# Altium schematic sheet DM.SchDoc
size A2; SPICEModelCacheAXZJKOIU: <root> / <DocumentId>AXZJKOIU</DocumentId> / <CacheFrame Number="0"> / <Model Name="mcp65r41_2402" Kind="CKT"> / <Text>.SUBCKT MCP65R41_2402 1 2 3 4 5 6 / *                     | | | | | | / *                     | | | | | VRef / *                     | | | | Output / *                     | | | Negative Supply / *                     | | Positive Supply / *                     | Inverting Input / *                     Non-inverting Input / * / ******************************************************************************** / * Software License Agreement                                                   * / *                                                                              * / * The software supplied herewith by Microchip Technology Incorporated (the     * / * 'Company') is intended and supplied to you, the Company's customer, for use  * / * soley and exclusively on Microchip products.                                 * / *                                                                              * / * The software is owned by the Company and/or its supplier, and is protected   * / * under applicable copyright laws. All rights are reserved. Any use in         * / * violation of the foregoing restrictions may subject the user to criminal     * / * sanctions under applicable laws, as well as to civil liability for the       * / * breach of the terms and conditions of this license.                          * / *                                                                              * / * THIS SOFTWARE IS PROVIDED IN AN 'AS IS' CONDITION. NO WARRANTIES, WHETHER    * / * EXPRESS, IMPLIED OR STATUTORY, INCLUDING, BUT NOT LIMITED TO, IMPLIED        * / * WARRANTIES OF MERCHANTABILITY AND FITNESS FOR A PARTICULAR PURPOSE APPLY TO  * / * THIS SOFTWARE. THE COMPANY SHALL NOT, IN ANY CIRCUMSTANCES, BE LIABLE FOR    * / * SPECIAL, INCIDENTAL OR CONSEQUENTIAL DAMAGES, FOR ANY REASON WHATSOEVER.     * / ******************************************************************************** / * / * The following op-amps are covered by this model: / *      MCP65R41_2402 / * / * / * Revision History: / *      REV A: 19-May-11, Created model / * / * / * / * / * Recommendations: / *      Use PSPICE (or SPICE 2G6; other simulators may require translation) / *      For a quick, effective design, use a combination of: data sheet / *            specs, bench testing, and simulations with this macromodel / *      For high impedance circuits, set GMIN=100F in the .OPTIONS statement / *      Can disable Hysteresis for faster response in large circuits by adding comments / *      in front of statements flagged below / * / * Supported: / *      Typical performance for temperature range (-40 to 125) degrees Celsius / *      DC, AC, Transient, and Noise analyses. / *      Most specs, including: offsets, DC PSRR, DC CMRR, input impedance, / *            open loop gain, voltage ranges, supply current, ... , etc. / *      Temperature effects for Ibias, Iquiescent, Iout short circuit / *            current, Vsat on both rails, Slew Rate vs. Temp and P.S. / * / * Not Supported: / *      Some Variation in specs vs. Power Supply Voltage / *      Vos distribution, Ib distribution for Monte Carlo / *      Distortion (detailed non-linear behavior) / *      Some Temperature analysis / *      Process variation / *      Behavior outside normal operating region / * / * / * / * Input Stage / * / V10  3 10 -500M / R10 10 11 218K / R11 10 12 218K / G10 10 11 10 11 458U / G11 10 12 10 12 458U / C11 11 12 1.82E-15 / C12  1  0 4.00P / *E12 71 14 POLY(6) 20 0 21 0 22 0 23 0 26 0 27 0   0.00 49.3K 49.3K 49.3K 49.3K 1 1 / E12 71 14 POLY(7) 20 0 21 0 22 0 23 0 26 0 27 0 111 0 / + 0.00 55 55 15 15 1 1 -.5M / *+ 1.5M 55 55 15 15 1 1 -.5M / * LINE ABOVE FOR HYSTERESIS, LINE BELOW FOR NO HYSTERESIS / *+ 1.5M 55 55 15 15 1 1 0 / G12 1 0 62 0 1m / G13 1 2 63 0 1u / M12 11 14 15 15 NMI / M14 12 2 15 15 NMI / G14 2 0 62 0 1m / C14  2  0 4.00P / I15 15 4 500U / V16 16 4 -300M / GD16 16 1 TABLE {V(16,1)} ((-100,-100E-15)(0,0)(1m,1u)(2m,1m)) / V13 3 13 -300M / GD13 2 13 TABLE {V(2,13)} ((-100,-100E-15)(0,0)(1m,1u)(2m,1m)) / R71  1  0 10.0E12 / R72  2  0 10.0E12 / R73  1  2 10.0E12 / C13  1  2 2.00P / * / * Noise, PSRR, and CMRR / * / I20 21 20 423U / D20 20  0 DN1 / D21  0 21 DN1 / I22 22 23 1N / R22 22 0  1k / R23  0 23 1k / G26  0 26 POLY(2) 3 0 4 0   0.00 -70.7U -125U / R26 26  0 1 / G27  0 27 POLY(2) 1 0 2 0  -2.19M 125U 125U / R27 27  0 1 / * / * Open Loop Gain, Slew Rate / * / G30  0 30 12 11 1 / R30 30  0 1.00K / G31 0 31 3 4 18.6 / I31 0 31 DC -82.1M / R31 31  0 1 TC=0.00,0.00 / GD31 30 0 TABLE {V(30,31)} ((-100,-1n)(0,0)(1m,0.1)(2m,2)) / G32 32 0 3 4 18.6 / I32 32 0 DC -82.1M / R32 32  0 1 TC=0.00,0.00 / GD32 0 30 TABLE {V(30,32)} ((-2m,2)(-1m,0.1)(0,0)(100,-1n)) / G33  0 33 30 0 1m / R33  33 0 1K / G34  0 34 33 0 1.00 / R34  34 0 1K / C34  34 0 15.9U / G37  0 37 34 0 1m / R37  37 0 1K / C37  37 0 15.9E-15 / G38  0 38 37 0 1m / R38  39 0 1K / L38  38 39 15.9N / E38  35 0 38 0 1 / G35 33 0 TABLE {V(35,3)} ((-1,-1n)(0,0)(2.00,1n))(2.2,1)) / G36 33 0 TABLE {V(35,4)} ((-2.2,-1)((-2.00,-1n)(0,0)(1,1n)) / * / * Output Stage / * / R80 50 0 100MEG / G50 0 50 57 96 2 / R58 57  96 0.50 / R57 57  0 10.0 / C58  5  0 2.00P / G57  0 57 POLY(3) 3 0 4 0 35 0 0 37.5M 50.0M 100M / GD55 55 57 TABLE {V(55,57)} ((-2m,-1)(-1m,-1m)(0,0)(10,1n)) / GD56 57 56 TABLE {V(57,56)} ((-2m,-1)(-1m,-1m)(0,0)(10,1n)) / E55 55  0 POLY(2) 3 0 51 0 4.7M 1 -48.5M / E56 56  0 POLY(2) 4 0 52 0 9.9M 1 -36.5M / R51 51 0 1k / R52 52 0 1k / GD51 50 51 TABLE {V(50,51)} ((-10,-1n)(0,0)(1m,1m)(2m,1)) / GD52 50 52 TABLE {V(50,52)}  ((-2m,-1)(-1m,-1m)(0,0)(10,1n)) / G53  3  0 POLY(1) 51 0  -500U 1M / G54  0  4 POLY(1) 52 0  -500U -1M / * / * Current Limit / * / G99 96 5 99 0 1 / R98 0 98 1 TC=-2.45M,-4.74U / G97 0 98 TABLE { V(96,5) } ((-11.0,-14.0M)(-1.00M,-13.8M)(0,0)(1.00M,13.8M)(11.0,14.0M)) / *E97 99 0 VALUE { V(98)*((V(3)-V(4))*738M + -1.21)} / E97 99 0 VALUE { V(98)*LIMIT(((V(3)-V(4))*738M + -1.21),0.00,1E6)} / D98 4 5 DESD / D99 5 3 DESD / * / * Temperature / Voltage Sensitive IQuiscent / * / R61 0 61 1 TC=3.54M,-1.28U / G61 3 4 61 0 1 / G60 0 61 TABLE {V(3, 4)} / *+ ((0,0)(600M,25.1N)(1.8,2.5U)(2.00,2.5U) / + ((0,0)(600M,25.1N)(0.85,0.50u)(1.15,2.5u)(1.2,3u)(1.35,3.7u)(1.4,3.8u)(1.45,3.7u)(1.5,2.5u)(1.8,2.5U)(2.00,2.5U) / + (3.00,2.5U)(5.00,2.51U)(6.00,2.52U)) / * / * Temperature Sensitive offset voltage / * / I73 0 70 DC 1uA / *R74 0 70 1 TC=10.0 / R74 0 70 1 TC=0.00 / E75 1 71 70 0 1 / * / * Temp Sensistive IBias / * / I62 0 62 DC 1uA / R62 0 62 REXP  349.81393U / * / * Temp Sensistive Offset IBias / * / I63 0 63 DC 1uA / R63 0 63 200M TC=12.0M,128U / * / * Hysteresis / * / G110 0 110 POLY(2) 3 0 4 0  10.4 -50M 50M / R110 110 0 1 TC=0.5M,0 / E111 111 0 VALUE { V(110) * V(112) } / E112 112 0 TABLE {V(120,0)} ((-1,1)(-1m,0.99)(1m,-0.99)(1,-1)) / C120  120 0  1u / G120 0 120 TABLE {V(57,4)} ((-1m,-1)(1m,1)) / R120 0 120 1 / C121 121 120 2p / C122 122 120 2p / V121 121 0 1 / V122 122 0 -1 / * Node 120 above is output of FF.  Can substitute with node 57 for / * direct input from output state. / * / * Begin - VRef Subcircuit Added 05-16-11 / * / R200 4 200  1 TC=3.35e-5,-4.55e-7 / E200 201 4 200 4 1 / VF200 202 6 0 / F200 3 4 VF200 1 / G200 201 202 TABLE { V(201, 202) } / + ( (-5.5,-0.010)(-1u,-500u)(0,0) (1u,500u)(5.5,0.012) ) / G201 4 200 TABLE { V(3, 4) } / + ( (0,0)(1.79,0.0)(1.80,1.80)(2.35,2.35)(2.37,2.37)(2.39,2.39)(2.40,2.40)(5.5,2.40)) / * / * End - VRef Subcircuit / * / * Models / .MODEL NMI NMOS(L=2.00U W=42.0U KP=20.0U LEVEL=1 ) / .MODEL DESD  D   N=1 IS=1.00E-15 / .MODEL DN1 D   IS=1P KF=50.0P AF=1 / .MODEL REXP  RES TCE= 7.71929 / .ENDS MCP65R41_2402</Text> / </Model> / </CacheFrame> / </root>
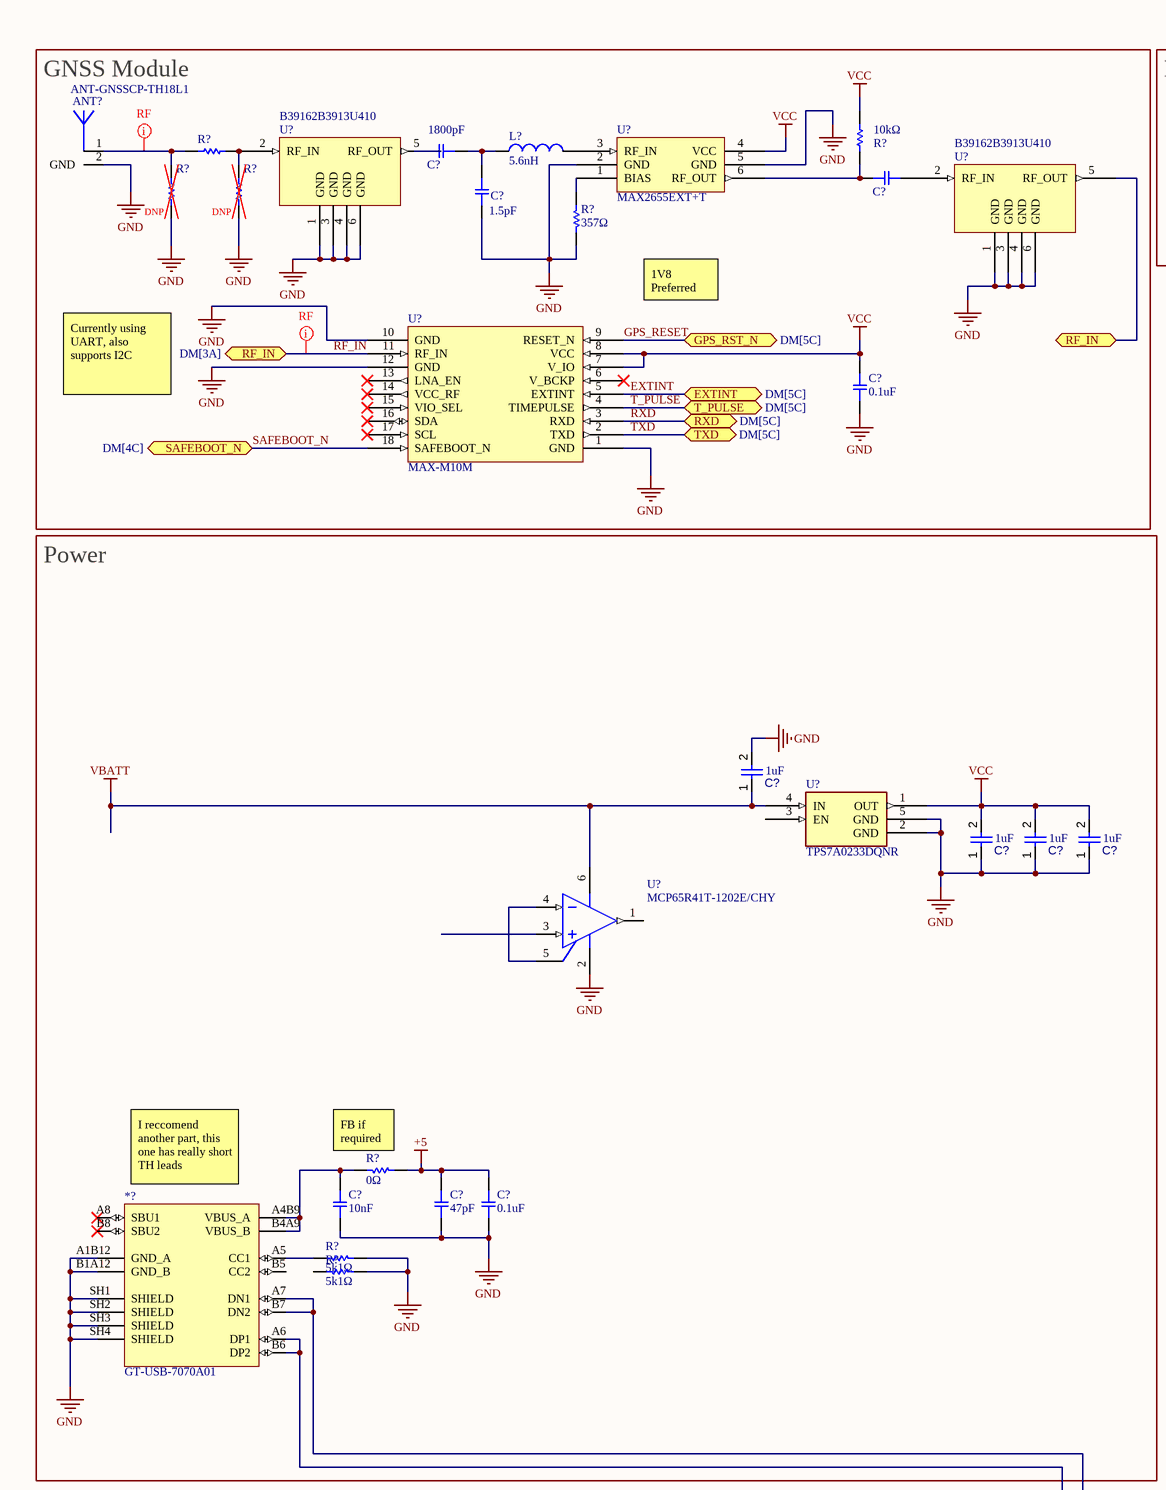
[diagram p0: DM.SchDoc, left]
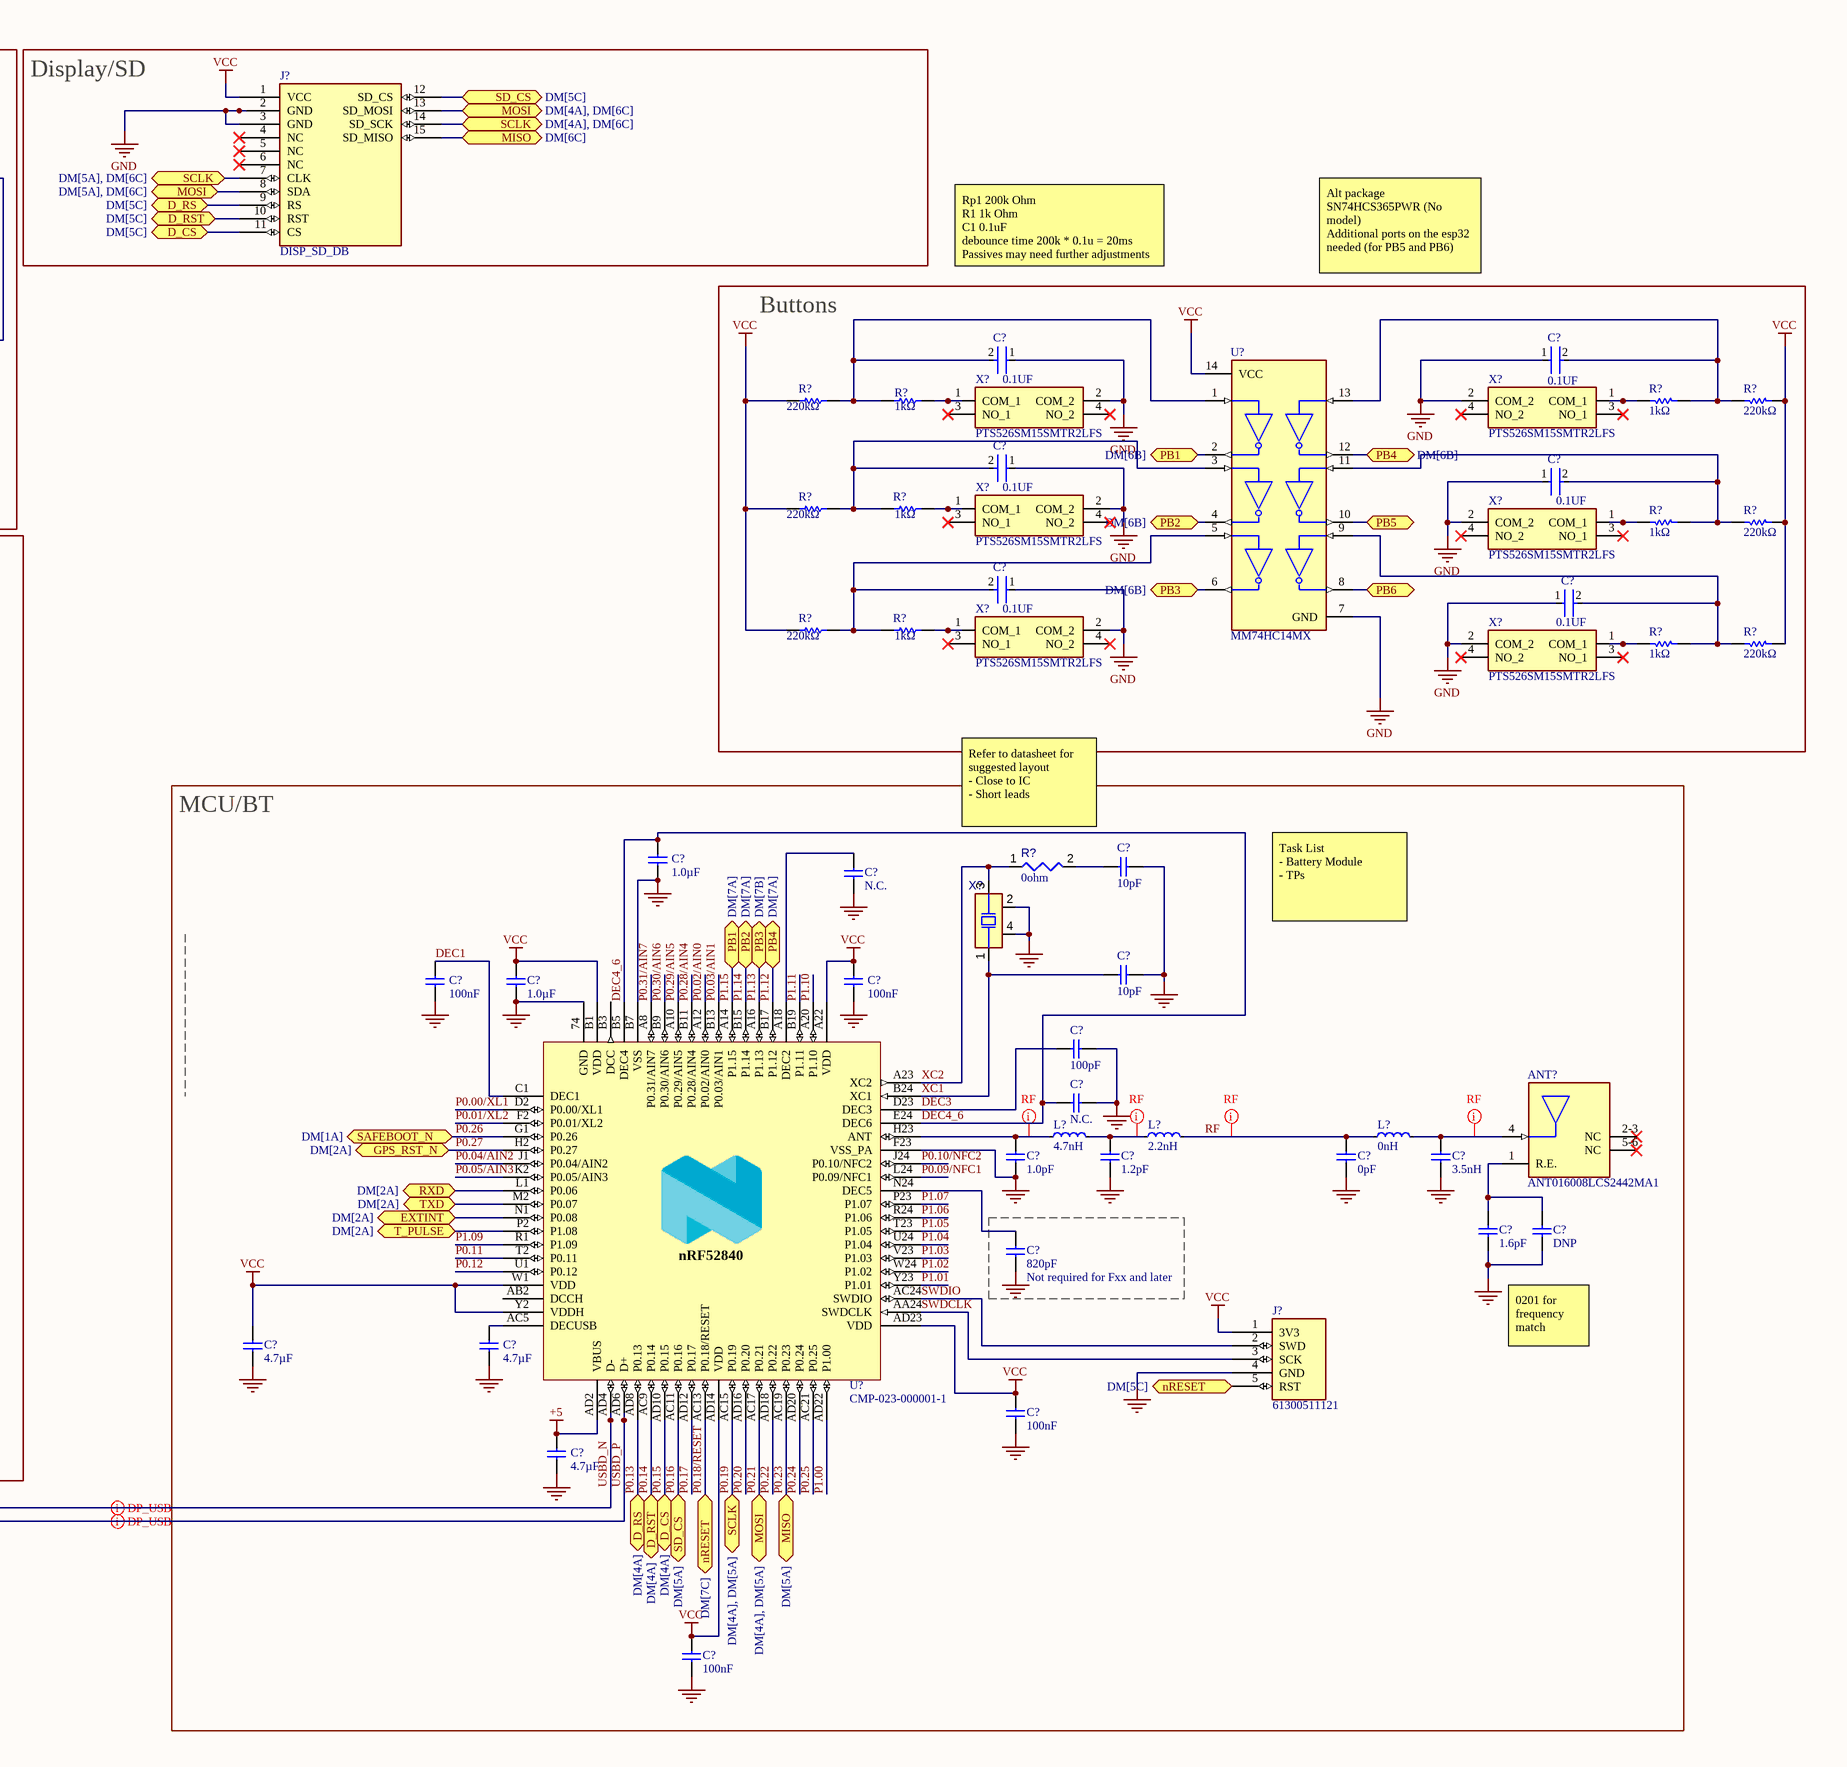
[diagram p1: DM.SchDoc, right]

## Parts
(Parts that share a designator on the sheet are numbered #1, #2 ... from top to bottom, then left to right.)
*?  GT-USB-7070A01  [GT-USB-7070A01-Footprint-1]
ANT?#1  ANT-GNSSCP-TH18L1  [ANT-GNSSCP-TH18L1]
ANT?#2  ANT016008LCS2442MA1  [FP-ANT016-MFG]
C?#1  Capacitance: 1800pF  [0402_CAP]  (hidden comment: GRM1555C1H102JA01D)
C?#2  GRM1555C1H102JA01D  [0402_CAP]  (value not drawn)
C?#3  Capacitance: 1.5pF  [0402_CAP]  (hidden comment: GRM1555C1H102JA01D)
C?#4  0.1UF  [FP-GRM15-MFG]
C?#5  0.1UF  [FP-GRM15-MFG]
C?#6  Capacitance: 0.1uF  [CAP_MURATA_0603]  (hidden comment: GCM188L81H104KA57D)
C?#7  0.1UF  [FP-GRM15-MFG]
C?#8  0.1UF  [FP-GRM15-MFG]
C?#9  0.1UF  [FP-GRM15-MFG]
C?#10  0.1UF  [FP-GRM15-MFG]
C?#11  value 1uF  (hidden comment: Capacitors,1uF)
C?#12  N.C.  [CAPC1005X04L]
C?#13  value 1uF  (hidden comment: Capacitors,1uF)
C?#14  value 1uF  (hidden comment: Capacitors,1uF)
C?#15  value 1uF  (hidden comment: Capacitors,1uF)
C?#16  10pF  [CAPC1005X04L]
C?#17  1.0µF  [CAPC1608X06L]
C?#18  100nF  [CAPC1005X04L]
C?#19  1.0µF  [CAPC1608X06L]
C?#20  100nF  [CAPC1005X04L]
C?#21  10pF  [CAPC1005X04L]
C?#22  100pF  [CAPC1005X04L]
C?#23  N.C.  [CAPC1005X04L]
C?#24  1.0pF  [CAPC1005X04L]
C?#25  1.2pF  [CAPC1005X04L]
C?#26  0pF  [CAPC1005X04L]
C?#27  3.5nH  [CAPC1005X04L]
C?#28  Capacitance: 10nF  [CAP_MURATA_0603]  (hidden comment: GCM188L81H104KA57D)
C?#29  Capacitance: 47pF  [CAP_MURATA_0603]  (hidden comment: GCM188L81H104KA57D)
C?#30  Capacitance: 0.1uF  [CAP_MURATA_0603]  (hidden comment: GCM188L81H104KA57D)
C?#31  820pF  Assembly: Not required for Fxx and later  [CAPC1005X04L]
C?#32  1.6pF  [CAPC1005X04L]
C?#33  DNP  [CAPC1005X04L]
C?#34  4.7µF  [CAPC1608X06L]
C?#35  4.7µF  [CAPC1608X06L]
C?#36  100nF  [CAPC1005X04L]
C?#37  4.7µF  [CAPC1608X06L]
C?#38  100nF  [CAPC1005X04L]
J?#1  CMP-010-000000-2  [DISP_SD_DB-Footprint-1]  (value not drawn)
J?#2  61300511121  [61300511121]
L?#1  value 5.6nH  [INDC1006X60N]  (hidden comment: LQW15AN3N6C10D)
L?#2  4.7nH  [INDC1005X04L]
L?#3  2.2nH  [INDC1005X04L]
L?#4  0nH  [INDC1005X04L]
R?#1  Resistance: 10kΩ  [0402_CAP]  (hidden comment: RC0402JR-070RL)
R?#2  RC0402JR-070RL  [0402_CAP]  (value not drawn)
R?#3  RC0402JR-070RL  [0402_CAP]  (value not drawn)
R?#4  RC0402JR-070RL  [0402_CAP]  (value not drawn)
R?#5  Resistance: 357Ω  [RC0603JR-070RL]
R?#6  220kΩ  [RESC2013X55X40ML15T20]
R?#7  1kΩ  [RESC2013X50X30ML20T20]
R?#8  1kΩ  [RESC2013X50X30ML20T20]
R?#9  220kΩ  [RESC2013X55X40ML15T20]
R?#10  220kΩ  [RESC2013X55X40ML15T20]
R?#11  1kΩ  [RESC2013X50X30ML20T20]
R?#12  1kΩ  [RESC2013X50X30ML20T20]
R?#13  220kΩ  [RESC2013X55X40ML15T20]
R?#14  220kΩ  [RESC2013X55X40ML15T20]
R?#15  1kΩ  [RESC2013X50X30ML20T20]
R?#16  1kΩ  [RESC2013X50X30ML20T20]
R?#17  220kΩ  [RESC2013X55X40ML15T20]
R?#18  value 0ohm  (hidden comment: Resistors,0ohm)
R?#19  Resistance: 0Ω  [RC0603JR-070RL]  (hidden comment: RC0603JR-070RL)
R?#20  Resistance: 5k1Ω  [RC0603JR-070RL]  (hidden comment: RC0603JR-070RL)
R?#21  Resistance: 5k1Ω  [RC0603JR-070RL]  (hidden comment: RC0603JR-070RL)
U?#1  B39162B3913U410  [B39162B3913U410]
U?#2  MAX2655EXT+T  [MAX2655EXT+T]
U?#3  B39162B3913U410  [B39162B3913U410]
U?#4  CMP-033-000000-1  [MAX-M10M]  (value not drawn)
U?#5  MM74HC14MX  [FP-751EF-IPC_A]
U?#6  TPS7A0233DQNR
U?#7  MCP65R41T-1202E/CHY  [SOT-23-CHY6_M]
U?#8  CMP-023-000001-1  [AQFN50P700X700X85_HS-74N]
X?#1  PTS526SM15SMTR2LFS  [PTS526SM15SMTR2LFS]
X?#2  PTS526SM15SMTR2LFS  [PTS526SM15SMTR2LFS]
X?#3  PTS526SM15SMTR2LFS  [PTS526SM15SMTR2LFS]
X?#4  PTS526SM15SMTR2LFS  [PTS526SM15SMTR2LFS]
X?#5  PTS526SM15SMTR2LFS  [PTS526SM15SMTR2LFS]
X?#6  PTS526SM15SMTR2LFS  [PTS526SM15SMTR2LFS]
X?#7  FA-128 32.0000MF20X-K5  [BT-XTAL_2016]  (value not drawn)

## Blocks framed on the sheet
GNSS Module: ANT?#1 C?#1-C?#3 C?#6 L?#1 R?#1-R?#5 U?#1-U?#4
Display/SD: J?#1
Buttons: C?#4 C?#5 C?#7-C?#10 R?#6-R?#17 U?#5 X?#1-X?#6
Power: *? C?#11 C?#13-C?#15 C?#28-C?#30 R?#19-R?#21 U?#6 U?#7
MCU/BT: ANT?#2 C?#12 C?#16-C?#27 C?#31-C?#38 J?#2 L?#2-L?#4 R?#18 U?#8 X?#7

## Ports
D_CS (bidir, see DM[4A]), D_CS (bidir, see DM[5C]), D_RS (bidir, see DM[4A]), D_RS (bidir, see DM[5C]), D_RST (bidir, see DM[4A]), D_RST (bidir, see DM[5C]), EXTINT (bidir, see DM[2A]), EXTINT (bidir, see DM[5C]), GPS_RST_N (bidir, see DM[2A]), GPS_RST_N (bidir, see DM[5C]), MISO (bidir, see DM[5A]), MISO (bidir, see DM[6C]), MOSI (bidir, see DM[4A], DM[5A]), MOSI (bidir, see DM[4A], DM[6C]), MOSI (bidir, see DM[5A], DM[6C]), nRESET (bidir, see DM[5C]), nRESET (bidir, see DM[7C]), PB1 (bidir, see DM[6B]), PB1 (bidir, see DM[7A]), PB2 (bidir, see DM[6B]), PB2 (bidir, see DM[7A]), PB3 (bidir, see DM[6B]), PB3 (bidir, see DM[7B]), PB4 (bidir, see DM[6B]), PB4 (bidir, see DM[7A]), PB5 (bidir), PB6 (bidir), RF_IN (bidir, see DM[1A]), RF_IN (bidir, see DM[3A]), RXD (bidir, see DM[2A]), RXD (bidir, see DM[5C]), SAFEBOOT_N (bidir, see DM[1A]), SAFEBOOT_N (bidir, see DM[4C]), SCLK (bidir, see DM[4A], DM[5A]), SCLK (bidir, see DM[4A], DM[6C]), SCLK (bidir, see DM[5A], DM[6C]), SD_CS (bidir, see DM[5A]), SD_CS (bidir, see DM[5C]), T_PULSE (bidir, see DM[2A]), T_PULSE (bidir, see DM[5C]), TXD (bidir, see DM[2A]), TXD (bidir, see DM[5C])

## Nets
+5: C?#29.1 C?#30.1 C?#37.1 R?#19.1 U?#8.AD2(VBUS)
GND: *?.A1B12(GND_A) *?.B1A12(GND_B) *?.SH1(SHIELD) *?.SH2(SHIELD) *?.SH3(SHIELD) *?.SH4(SHIELD) ANT?#1.2(GND) C?#3.1 C?#4.1 C?#5.1 C?#6.1 C?#7.1 C?#8.1 C?#9.1 C?#10.1 C?#11.2 C?#12.2 C?#13.1 C?#14.1 C?#15.1 C?#16.2 C?#17.1 C?#18.2 C?#19.2 C?#20.2 C?#21.2 C?#22.2 C?#23.1 C?#24.1 C?#25.1 C?#26.1 C?#27.1 C?#28.2 C?#29.2 C?#30.2 C?#31.2 C?#32.1 C?#33.1 C?#34.2 C?#35.2 C?#36.2 C?#37.2 C?#38.2 J?#1.2(GND) J?#1.3(GND) J?#2.4(GND) R?#3.1 R?#4.1 R?#5.2 R?#20.1 R?#21.1 U?#1.1(GND) U?#1.3(GND) U?#1.4(GND) U?#1.6(GND) U?#2.2(GND) U?#2.5(GND) U?#3.1(GND) U?#3.3(GND) U?#3.4(GND) U?#3.6(GND) U?#4.1(GND) U?#4.10(GND) U?#4.12(GND) U?#5.7(GND) U?#6.2(GND) U?#6.5(GND) U?#7.2(VSS) U?#8.74(GND) U?#8.B7(VSS) U?#8.F23(VSS_PA) X?#1.2(COM_2) X?#2.2(COM_2) X?#3.2(COM_2) X?#4.2(COM_2) X?#5.2(COM_2) X?#6.2(COM_2) X?#7.2(NC) X?#7.4(NC)
VBATT: C?#11.1 U?#6.4(IN) U?#7.6(VDD)
VCC: C?#6.2 C?#13.2 C?#14.2 C?#15.2 C?#19.1 C?#20.1 C?#34.1 C?#36.1 C?#38.1 J?#1.1(VCC) J?#2.1(3V3) R?#1.1 R?#6.1 R?#9.1 R?#10.1 R?#13.1 R?#14.1 R?#17.1 U?#2.4(VCC) U?#4.7(V_IO) U?#4.8(VCC) U?#5.14(VCC) U?#6.1(OUT) U?#8.A22(VDD) U?#8.AD14(VDD) U?#8.AD23(VDD) U?#8.B1(VDD) U?#8.W1(VDD) U?#8.Y2(VDDH)
DEC1: C?#18.1 U?#8.C1(DEC1)
DEC3: C?#22.1 U?#8.D23(DEC3)
DEC4_6: C?#17.2 C?#23.2 U?#8.B5(DEC4) U?#8.E24(DEC6)
EXTINT: U?#4.5(EXTINT) U?#8.N1(P0.08) ; port EXTINT
GPS_RESET: U?#4.9(RESET_N) U?#8.H2(P0.27) ; port GPS_RST_N  [also labelled P0.27]
P0.00/XL1: U?#8.D2(P0.00/XL1)
P0.01/XL2: U?#8.F2(P0.01/XL2)
P0.02/AIN0: U?#8.A12(P0.02/AIN0)
P0.03/AIN1: U?#8.B13(P0.03/AIN1)
P0.04/AIN2: U?#8.J1(P0.04/AIN2)
P0.05/AIN3: U?#8.K2(P0.05/AIN3)
P0.09/NFC1: U?#8.L24(P0.09/NFC1)
P0.10/NFC2: U?#8.J24(P0.10/NFC2)
P0.11: U?#8.T2(P0.11)
P0.12: U?#8.U1(P0.12)
P0.13: J?#1.9(RS) U?#8.AD8(P0.13) ; port D_RS
P0.14: J?#1.10(RST) U?#8.AC9(P0.14) ; port D_RST
P0.15: J?#1.11(CS) U?#8.AD10(P0.15) ; port D_CS
P0.16: J?#1.12(SD_CS) U?#8.AC11(P0.16) ; port SD_CS
P0.17: U?#8.AD12(P0.17)
P0.18/RESET: J?#2.5(RST) U?#8.AC13(P0.18/RESET) ; port nRESET
P0.19: J?#1.7(CLK) J?#1.14(SD_SCK) U?#8.AC15(P0.19) ; port SCLK
P0.20: U?#8.AD16(P0.20)
P0.21: J?#1.8(SDA) J?#1.13(SD_MOSI) U?#8.AC17(P0.21) ; port MOSI
P0.22: U?#8.AD18(P0.22)
P0.23: J?#1.15(SD_MISO) U?#8.AC19(P0.23) ; port MISO
P0.24: U?#8.AD20(P0.24)
P0.25: U?#8.AC21(P0.25)
P0.26: U?#4.18(SAFEBOOT_N) U?#8.G1(P0.26) ; port SAFEBOOT_N  [also labelled SAFEBOOT_N]
P0.28/AIN4: U?#8.B11(P0.28/AIN4)
P0.29/AIN5: U?#8.A10(P0.29/AIN5)
P0.30/AIN6: U?#8.B9(P0.30/AIN6)
P0.31/AIN7: U?#8.A8(P0.31/AIN7)
P1.00: U?#8.AD22(P1.00)
P1.01: U?#8.Y23(P1.01)
P1.02: U?#8.W24(P1.02)
P1.03: U?#8.V23(P1.03)
P1.04: U?#8.U24(P1.04)
P1.05: U?#8.T23(P1.05)
P1.06: U?#8.R24(P1.06)
P1.07: U?#8.P23(P1.07)
P1.09: U?#8.R1(P1.09)
P1.10: U?#8.A20(P1.10)
P1.11: U?#8.B19(P1.11)
P1.12: U?#5.12(Y6) U?#8.B17(P1.12) ; port PB4
P1.13: U?#5.6(Y3) U?#8.A16(P1.13) ; port PB3
P1.14: U?#5.4(Y2) U?#8.B15(P1.14) ; port PB2
P1.15: U?#5.2(Y1) U?#8.A14(P1.15) ; port PB1
PB5: U?#5.10(Y5) ; port PB5
PB6: U?#5.8(Y4) ; port PB6
RF: C?#26.2 L?#3.2 L?#4.1
RF_IN: U?#3.5(RF_OUT) U?#4.11(RF_IN) ; port RF_IN
RXD: U?#4.3(RXD) U?#8.L1(P0.06) ; port RXD
SWDCLK: J?#2.3(SCK) U?#8.AA24(SWDCLK)
SWDIO: J?#2.2(SWD) U?#8.AC24(SWDIO)
T_PULSE: U?#4.4(TIMEPULSE) U?#8.P2(P1.08) ; port T_PULSE
TXD: U?#4.2(TXD) U?#8.M2(P0.07) ; port TXD
USBD_N: *?.A7(DN1) *?.B7(DN2) U?#8.AD4(D-)
USBD_P: *?.A6(DP1) *?.B6(DP2) U?#8.AD6(D+)
XC1: C?#21.1 U?#8.B24(XC1) X?#7.1(X1)
XC2: R?#18.1 U?#8.A23(XC2) X?#7.3(X2)
Net*?_A4B9: *?.A4B9(VBUS_A) *?.B4A9(VBUS_B) C?#28.1 R?#19.2
Net*?_A5: *?.A5(CC1) R?#20.2
NetANT?#1_1: ANT?#1.1(RF_IN) R?#2.2 R?#3.2
NetANT?#2_1: ANT?#2.1(R.E.) C?#32.2 C?#33.2
NetANT?#2_4: ANT?#2.4(Feed_point) C?#27.2 L?#4.2
NetC?#1_1: C?#1.1 C?#3.2 L?#1.1
NetC?#1_2: C?#1.2 U?#1.5(RF_OUT)
NetC?#2_1: C?#2.1 U?#3.2(RF_IN)
NetC?#2_2: C?#2.2 R?#1.2 U?#2.6(RF_OUT)
NetC?#4_2: C?#4.2 R?#6.2 R?#7.1 U?#5.1(A1)
NetC?#5_2: C?#5.2 R?#8.1 R?#9.2 U?#5.13(A6)
NetC?#7_2: C?#7.2 R?#10.2 R?#11.1 U?#5.3(A2)
NetC?#8_2: C?#8.2 R?#12.1 R?#13.2 U?#5.11(A5)
NetC?#9_2: C?#9.2 R?#14.2 R?#15.1 U?#5.5(A3)
NetC?#10_2: C?#10.2 R?#16.1 R?#17.2 U?#5.9(A4)
NetC?#12_1: C?#12.1 U?#8.A18(DEC2)
NetC?#16_1: C?#16.1 R?#18.2
NetC?#24_2: C?#24.2 L?#2.1 U?#8.H23(ANT)
NetC?#25_2: C?#25.2 L?#2.2 L?#3.1
NetC?#31_1: C?#31.1 U?#8.N24(DEC5)
NetC?#35_1: C?#35.1 U?#8.AC5(DECUSB)
NetL?#1_2: L?#1.2 U?#2.3(RF_IN)
NetR?#2_1: R?#2.1 R?#4.2 U?#1.2(RF_IN)
NetR?#5_1: R?#5.1 U?#2.1(BIAS)
NetR?#7_2: R?#7.2 X?#1.1(COM_1)
NetR?#8_2: R?#8.2 X?#2.1(COM_1)
NetR?#11_2: R?#11.2 X?#3.1(COM_1)
NetR?#12_2: R?#12.2 X?#4.1(COM_1)
NetR?#15_2: R?#15.2 X?#5.1(COM_1)
NetR?#16_2: R?#16.2 X?#6.1(COM_1)
NetU?#7_4: U?#7.4(VIN-) U?#7.5(VREF)

Not connected (* = marked no-connect by the designer): *? A8(SBU1)* B5(CC2) B8(SBU2)*; ANT?#2 2-3(NC)* 5-6(NC)*; J?#1 4(NC)* 5(NC)* 6(NC)*; R?#21 2; U?#4 6(V_BCKP)* 13(LNA_EN)* 14(VCC_RF)* 15(VIO_SEL)* 16(SDA)* 17(SCL)*; U?#6 3(EN); U?#7 1(OUT) 3(VIN+); U?#8 AB2(DCCH) B3(DCC); X?#1 3(NO_1)* 4(NO_2)*; X?#2 3(NO_1)* 4(NO_2)*; X?#3 3(NO_1)* 4(NO_2)*; X?#4 3(NO_1)* 4(NO_2)*; X?#5 3(NO_1)* 4(NO_2)*; X?#6 3(NO_1)* 4(NO_2)*

## Layout directives
net class RF: NetANT?#1_1, NetANT?#2_4, NetC?#24_2, NetC?#25_2, RF, RF_IN
differential pair; differential pair class USB: USBD_N, USBD_P

## Notes on the sheet
- (near R?#3) DNP
- (near R?#4) DNP
- 1V8 Preferred
- Rp1 200k Ohm
  R1 1k Ohm
  C1 0.1uF
  debounce time 200k * 0.1u = 20ms
  Passives may need further adjustments
- Alt package SN74HCS365PWR (No model)
  Additional ports on the esp32 needed (for PB5 and PB6)
- Currently using UART, also supports I2C
- Refer to datasheet for suggested layout
  - Close to IC
  - Short leads
- Task List
  - Battery Module
  - TPs
- (near *?) I reccomend another part, this one has really short TH leads
- (near R?#19) FB if required
- (near C?#33) 0201 for frequency match
- (in symbol CMP-023-000001-1) nRF52840

## Library data of the parts
*? = CMP-002-00072-1: USB 2.0 5A 1 260℃ Horizontal attachment 16P Female -40℃~+85℃ Gold High conductivity copper Type-C SMD USB Connectors...; Connector Type: USB 2.0 Type C; Voltage Rating: 24V; Case/Package: SMD; Gender: Female; Max Current Rating: 5A; Pins: 16; Mounting Technology: SMD; RoHS Compliant: Yes; Max Operating Temperature: 85°C; Min Operating Temperature: -40°C
ANT?#1 = ANT-GNSSCP-TH18L1: CERAMIC PATCH GNSS ANTENNA
ANT?#2 = CMP-00025-00005-2: RF/Microwave Antenna, 2400MHz Min, 2484MHz Max; Characteristic Impedance: 50R; RoHS Compliant: Yes; Construction: COMPONENT; Max Operating Temperature: 85°C; Min Operating Temperature: -40°C
C?#1 C?#3 = GRM1555C1H102JA01D: CAP CER 1000PF 50V C0G/NP0 0402
C?#2 = GRM1555C1H102JA01D: CAP CER 1000PF 50V C0G/NP0 0402; Capacitance: 1uF
C?#4 C?#5 C?#7-C?#10 = CMP-2100-03641-2: CAP CER 0.1UF 16V X7R 0402; Manufacturer Part Number: GRM155R71C104KA88D; Manufacturer: Murata; Standoff Height: 0mm; Tolerance: 10%; Description: CAP Ceramic 0.10μF 10% X7R 16Vdc 0402 SMD; Voltage Rating: 16Vdc; Material: Ceramic; Capacitance: 0.10μF; Value: 0.10μF; RoHS: TRUE; Temperature Characteristic: X7R; Octopart: https://octopart.com/grm155r71c104ka88d-murata-196880; Digikey Description: CAP CER 0.1UF 16V X7R 0402; Device Class L3: Ceramic Capacitors; Height: 0.55mm; ComponentLink2Description: Datasheet; Temperature Range Low: -55°C; Ipc Land Pattern Name: CAPC10050X219; ComponentLink2URL: https://search.murata.co.jp/Ceramy/image/img/A01X/G101/ENG/GRM155R71H471KA01-01A.pdf; Device Class L1: Passive Components; Lead Free: yes; Category: Cap; Package: GRM15; Temperature: -55°C to +125°C; Device Class L2: Capacitors; Temperature Range High: +125°C; Mouser Description: 0402 0.1 uF 16V ±10 % Tolerance X7R SMT Multilayer Ceramic Capacitor
C?#6 C?#28-C?#30 = GCM188L81H104KA57D: CAP CER 0.1UF 50V X8L 0603
C?#11 C?#13-C?#15 = Capacitors: Capacitor; Component Type: Capacitors
C?#12 C?#23 = C0402-N.C.: Not mounted; Pad Count: 2; Assembly: Not mounted; Part Number: C0402-N.C.; LatestRevisionDate: 2009-05-08; Published: 2009-05-08; Value: N.C.; Footprint Doc: 0402
C?#16 C?#21 = C0402-12p: Capacitor, NP0, ±2%; Pad Count: 2; Value: 12pF; Part Number: C0402-12p; LatestRevisionDate: 2011-05-11; Published: 2009-05-08; Footprint Doc: 0402
C?#17 C?#19 = C0603-1µ0: Capacitor, X7R, ±10%; Pad Count: 2; Part Number: C0603-1µ0; LatestRevisionDate: 2013-06-05; Published: 2009-05-08; Value: 1.0µF; Footprint Doc: 0603
C?#18 C?#20 C?#36 C?#38 = C0402-100n: Capacitor, X7R, ±10%; Pad Count: 2; Part Number: C0402-100n; LatestRevisionDate: 2009-11-23; Published: 2009-05-08; Value: 100nF; Footprint Doc: 0402
C?#22 = C0402-100p: Capacitor, NP0, ±5%; Pad Count: 2; Part Number: C0402-100p; LatestRevisionDate: 2009-05-08; Published: 2009-05-08; Value: 100pF; Footprint Doc: 0402
C?#24 C?#26 = C0402-0.8p: Capacitor, NP0, ±10%; Pad Count: 2; Value: 0.8pF; Part Number: C0402-0.8p; LatestRevisionDate: 2012-11-21; Published: 2009-05-08; Footprint Doc: 0402
C?#25 C?#27 C?#32 C?#33 = C0402-0.5p: Capacitor, NP0, ±10%; Pad Count: 2; Value: 0.5pF; Part Number: C0402-0.5p; LatestRevisionDate: 2017-02-23; Published: 2009-05-08; Footprint Doc: 0402
C?#31 = C0402-820p: Capacitor, NP0, ±5%; Pad Count: 2; Part Number: C0402-820p; LatestRevisionDate: 2009-05-08; Published: 2009-05-08; Value: 820pF; Footprint Doc: 0402
C?#34 C?#35 = C0603-4µ7-6.3V-X7R: Capacitor, X7R, ±10%; Pad Count: 2; Part Number: C0603-4µ7-6.3V-X7R; LatestRevisionDate: 2015-06-10; Published: 2015-06-10; Value: 4.7µF; Footprint Doc: 0603
C?#37 = C0603-4µ7-10V-X7S: Capacitor, X7S, ±10%; Pad Count: 2; Part Number: C0603-4µ7-10V-X7S; LatestRevisionDate: 2016-08-15; Published: 2016-08-15; Value: 4.7µF; Footprint Doc: 0603
J?#1 = CMP-010-000000-2: [UNFINISHED FP] 1.8in TFT COLOR SCREEN WITH SD CARD; Source: Display_Module.SchLib; Design Item ID: DISP_SD_DB
J?#2 = CMP-002-00073-1: Board Connector, 5 Contact(s), 1 Row(s), Male, Straight, 0.1 inch Pitch, Solder Terminal, Locking, Black Insulator, Plug; Body Length: 0.5inch; Body Depth: 0.1inch; Mounting Technology: Board; Max Operating Temperature: 125°C; Body Breadth: 0.1inch; Body/Shell Style: PLUG; Connector Type: BOARD CONNECTOR; Min Operating Temperature: -40°C; RoHS Compliant: Yes
L?#1 = LQW15AN3N6C10D: FIXED IND 3.6NH 900MA 40 MOHM; Package: None; Price: None; MP: LQW15AN3N6C10D; Availability: Unavailable
L?#2 = L0402-4n7: High frequency chip inductor ±5%; Pad Count: 2; Part Number: L0402-4n7; LatestRevisionDate: 2012-09-19; Published: 2009-05-08; Value: 4.7nH; Footprint Doc: 0402
L?#3 L?#4 = L0402-4n7: High frequency chip inductor ±5%; Pad Count: 2; Value: 4.7nH; Part Number: L0402-4n7; LatestRevisionDate: 2012-09-19; Published: 2009-05-08; Footprint Doc: 0402
R?#1 = RC0402JR-070RL: RES 0 OHM JUMPER 1/16W 0402; Manufacturer: Yageo; Temperature Coefficient: 200ppm/degreesC; Tolerance: 5%; Voltage Rating: 50V; Power Rating: 100mW; Width: 0.8mm; Max Operating Temperature: 155degC; Package Reference: 0603; Height: 0.45mm; Depth: 0.8mm; Package Description: 2-Pin Surface Mount Device, Body 1.6 x 0.8 mm; Termination: SMD/SMT; Package Quantity: 5000; Case/Package: 0603; Case Code (Imperial): 0603; Radiation Hardening: No; Number of Pins: 2; Length: 1.6mm; Lead Free: LeadFree; Voltage Rating (DC): 50V; Military Standard: Not; Datasheet URL: http://www.yageo.com/NewPortal/yageodocoutput?fileName=/pdf/R-Chip/PYu-RC_Group_51_RoHS_L_5.pdf; Manufacturer URL: http://www.yageo.com/; Packaging: TapeandReel; Case Code (Metric): 1608; Min Operating Temperature: -55degC; Composition: ThickFilm; RoHSCompliant: true; Contact Plating: Tin; Datasheet Version: Rev. 5, 10/2016; REACH SVHC: NoSVHC
R?#2-R?#4 = RC0402JR-070RL: RES 0 OHM JUMPER 1/16W 0402; Manufacturer: Yageo; Temperature Coefficient: 200ppm/degreesC; Tolerance: 5%; Voltage Rating: 50V; Power Rating: 100mW; Resistance: 0mOhm; Width: 0.8mm; Max Operating Temperature: 155degC; Package Reference: 0603; Height: 0.45mm; Depth: 0.8mm; Package Description: 2-Pin Surface Mount Device, Body 1.6 x 0.8 mm; Termination: SMD/SMT; Package Quantity: 5000; Case/Package: 0603; Case Code (Imperial): 0603; Radiation Hardening: No; Number of Pins: 2; Length: 1.6mm; Lead Free: LeadFree; Voltage Rating (DC): 50V; Military Standard: Not; Datasheet URL: http://www.yageo.com/NewPortal/yageodocoutput?fileName=/pdf/R-Chip/PYu-RC_Group_51_RoHS_L_5.pdf; Manufacturer URL: http://www.yageo.com/; Packaging: TapeandReel; Case Code (Metric): 1608; Min Operating Temperature: -55degC; Composition: ThickFilm; RoHSCompliant: true; Contact Plating: Tin; Datasheet Version: Rev. 5, 10/2016; REACH SVHC: NoSVHC
R?#5 R?#19-R?#21 = RC0603JR-070RL: Chip Resistor, 0 Ohm, +/- 5%, 0.1 W, -55 to 155 degC, 0603 (1608 Metric), RoHS, Tape and Reel; Manufacturer: Yageo; Temperature Coefficient: 200ppm/degreesC; Voltage Rating: 50V; Power Rating: 100mW; Width: 0.8mm; Max Operating Temperature: 155degC; Tolerance: 5%; Package Reference: 0603; Height: 0.45mm; Depth: 0.8mm; Package Description: 2-Pin Surface Mount Device, Body 1.6 x 0.8 mm; Termination: SMD/SMT; Package Quantity: 5000; Case/Package: 0603; Case Code (Imperial): 0603; Radiation Hardening: No; Number of Pins: 2; Length: 1.6mm; Lead Free: LeadFree; Voltage Rating (DC): 50V; Military Standard: Not; Datasheet URL: http://www.yageo.com/NewPortal/yageodocoutput?fileName=/pdf/R-Chip/PYu-RC_Group_51_RoHS_L_5.pdf; Manufacturer URL: http://www.yageo.com/; Packaging: TapeandReel; Case Code (Metric): 1608; Min Operating Temperature: -55degC; Composition: ThickFilm; RoHSCompliant: true; Contact Plating: Tin; Datasheet Version: Rev. 5, 10/2016; REACH SVHC: NoSVHC
R?#6 R?#9 R?#10 R?#13 R?#14 R?#17 = CMP-2001-04744-1: Manufacturer: Vishay Dale; Part Number: TNPW0805200KBEEN
R?#7 R?#8 R?#11 R?#12 R?#15 R?#16 = CMP-2001-03598-1: Part Number: CRCW08051K00JNTA; Manufacturer: Vishay Dale
R?#18 = Resistors: Resistor; Component Type: Resistors
U?#1 U?#3 = B39162B3913U410: FILTER SAW 1.588GHZ 6SMD
U?#2 = MAX2655EXT+T: IC AMP GPS 1.4GHZ-1.7GHZ SC70-6
U?#4 = CMP-033-000000-1: GNSS LCC RX MOD, ROM, CRYSTAL; Design Item ID: MAX-M10M; Source: Symbols.SchLib
U?#5 = CMP-031-00006-1: Inverter, HC/UH Series, 6-Func, 1-Input, CMOS, PDSO14; Prop. Delay@Nom-Sup: 38ns; Max Supply Voltage: 6V; Power Supplies: 2/6V; Propagation Delay (tpd): 156ns; Package Equivalence Code: SOP14,.25; Load Capacitance (CL): 50pF; Nominal Supply Voltage: 4.5V; Package Body Material: Plastic; Qualification Status: Not Qualified; Max I(ol): 4mA; Number of Inputs: 1; Schmitt Trigger: Yes; Min Supply Voltage: 2V; Channels: 6; Technology: CMOS; JESD-609 Code: e3; Pins: 14; Min Operating Temperature: -40°C; Surface Mount: Yes; Terminal Position: DUAL; Terminal Form: Gull Wing; Width: 3.9mm; Reach SVHC Compliant: Yes; Packaging: Tape and Reel; Terminal Pitch: 1.27mm; Terminal Finish: Tin; Max Operating Temperature: 85°C; Case/Package: SOP; Moisture Sensitivity Level: 1; RoHS Compliant: Yes; Temperature Grade: INDUSTRIAL; Package Shape: Rectangular; Logic Type: INVERTER; Package Style: SMALL OUTLINEMeter; Height - Seated (Max): 1.753mm; JESD-30 Code: R-PDSO-G14; Length: 8.6235mm
U?#7 = CMP-031-00007-1: Comparator, 1 Func, 10000uV Offset-Max, 4000ns Response Time, CMOS, PDSO6; Input Offset Voltage-Max: 10mV; Time @ Peak Reflow Temperature-Max (s): 40s; Nominal Supply Voltage: 5V; Package Body Material: Plastic; Output Type: PUSH-PULL; Power Supplies: 2.5V; Qualification Status: Not Qualified; Package Equivalence Code: TSOP6,.11,37; Channels: 1; Supply Voltage Limit-Max: 7V; Average Bias Current-Max (IIB): 5nA; Max Supply Current: 4uA; Technology: CMOS; Package Shape: Rectangular; JESD-609 Code: e4; Terminal Finish: Nickel; Moisture Sensitivity Level: 1; Pins: 6; Length: 2.9mm; Min Operating Temperature: -40°C; Temperature Grade: AUTOMOTIVE; JESD-30 Code: R-PDSO-G6; Terminal Form: Gull Wing; Terminal Position: DUAL; Surface Mount: Yes; Max Operating Temperature: 125°C; Width: 1.55mm; RoHS Compliant: Yes; Amplifier Type: COMPARATOR; Terminal Pitch: 0.95mm; Peak Reflow Temperature (Cel): 260°C; Reach SVHC Compliant: Yes; Package Style: SMALL OUTLINE, LOW PROFILE, SHRINK PITCHMeter; Case/Package: LSSOP; Height - Seated (Max): 1.45mm; Response Time-Nom: 4000ns
U?#8 = CMP-023-000001-1: Multi-protocol Bluetooth Low Energy, IEEE 802.15.4, ANT and 2.4GHz proprietary system-on-chip; Value: nRF52840-QIAA; Pad Count: 73; Part Number: nRF52840-QIAA; LatestRevisionDate: 2017-08-21; Published: 2017-08-21; Footprint Doc: AQFN-73; Design Item ID: nRF52840-QIAA; Source: nrf52840_qiaa.SCHLIB; Component Type: Standard; Pin Count: 74
X?#1-X?#6 = CMP-011-00014-1: Switch Tactile N.O. SPST Round Button Gull Wing 0.05A 12VDC 500000Cycles 1.57N SMD T/R
X?#7 = CMP-003-00035-2: 32 MHz ±10ppm Crystal 10pF 60 Ohms 4-SMD, No Lead; ESR: 80; Load Capacitance: 12pF; Frequency: 24MHz; Crystal/Resonator Type: PARALLEL - FUNDAMENTAL; Min Operating Temperature: -20°C; Reach SVHC Compliant: Yes; Max Operating Temperature: 75°C; JESD-609 Code: e4; RoHS Compliant: Yes; Pins: 4; Mounting Technology: SMT; Case/Package: SMD/SMT